# Altium schematic sheet IP2366_DEMO_V1.41(1).schdoc
size 406 x 279 mm
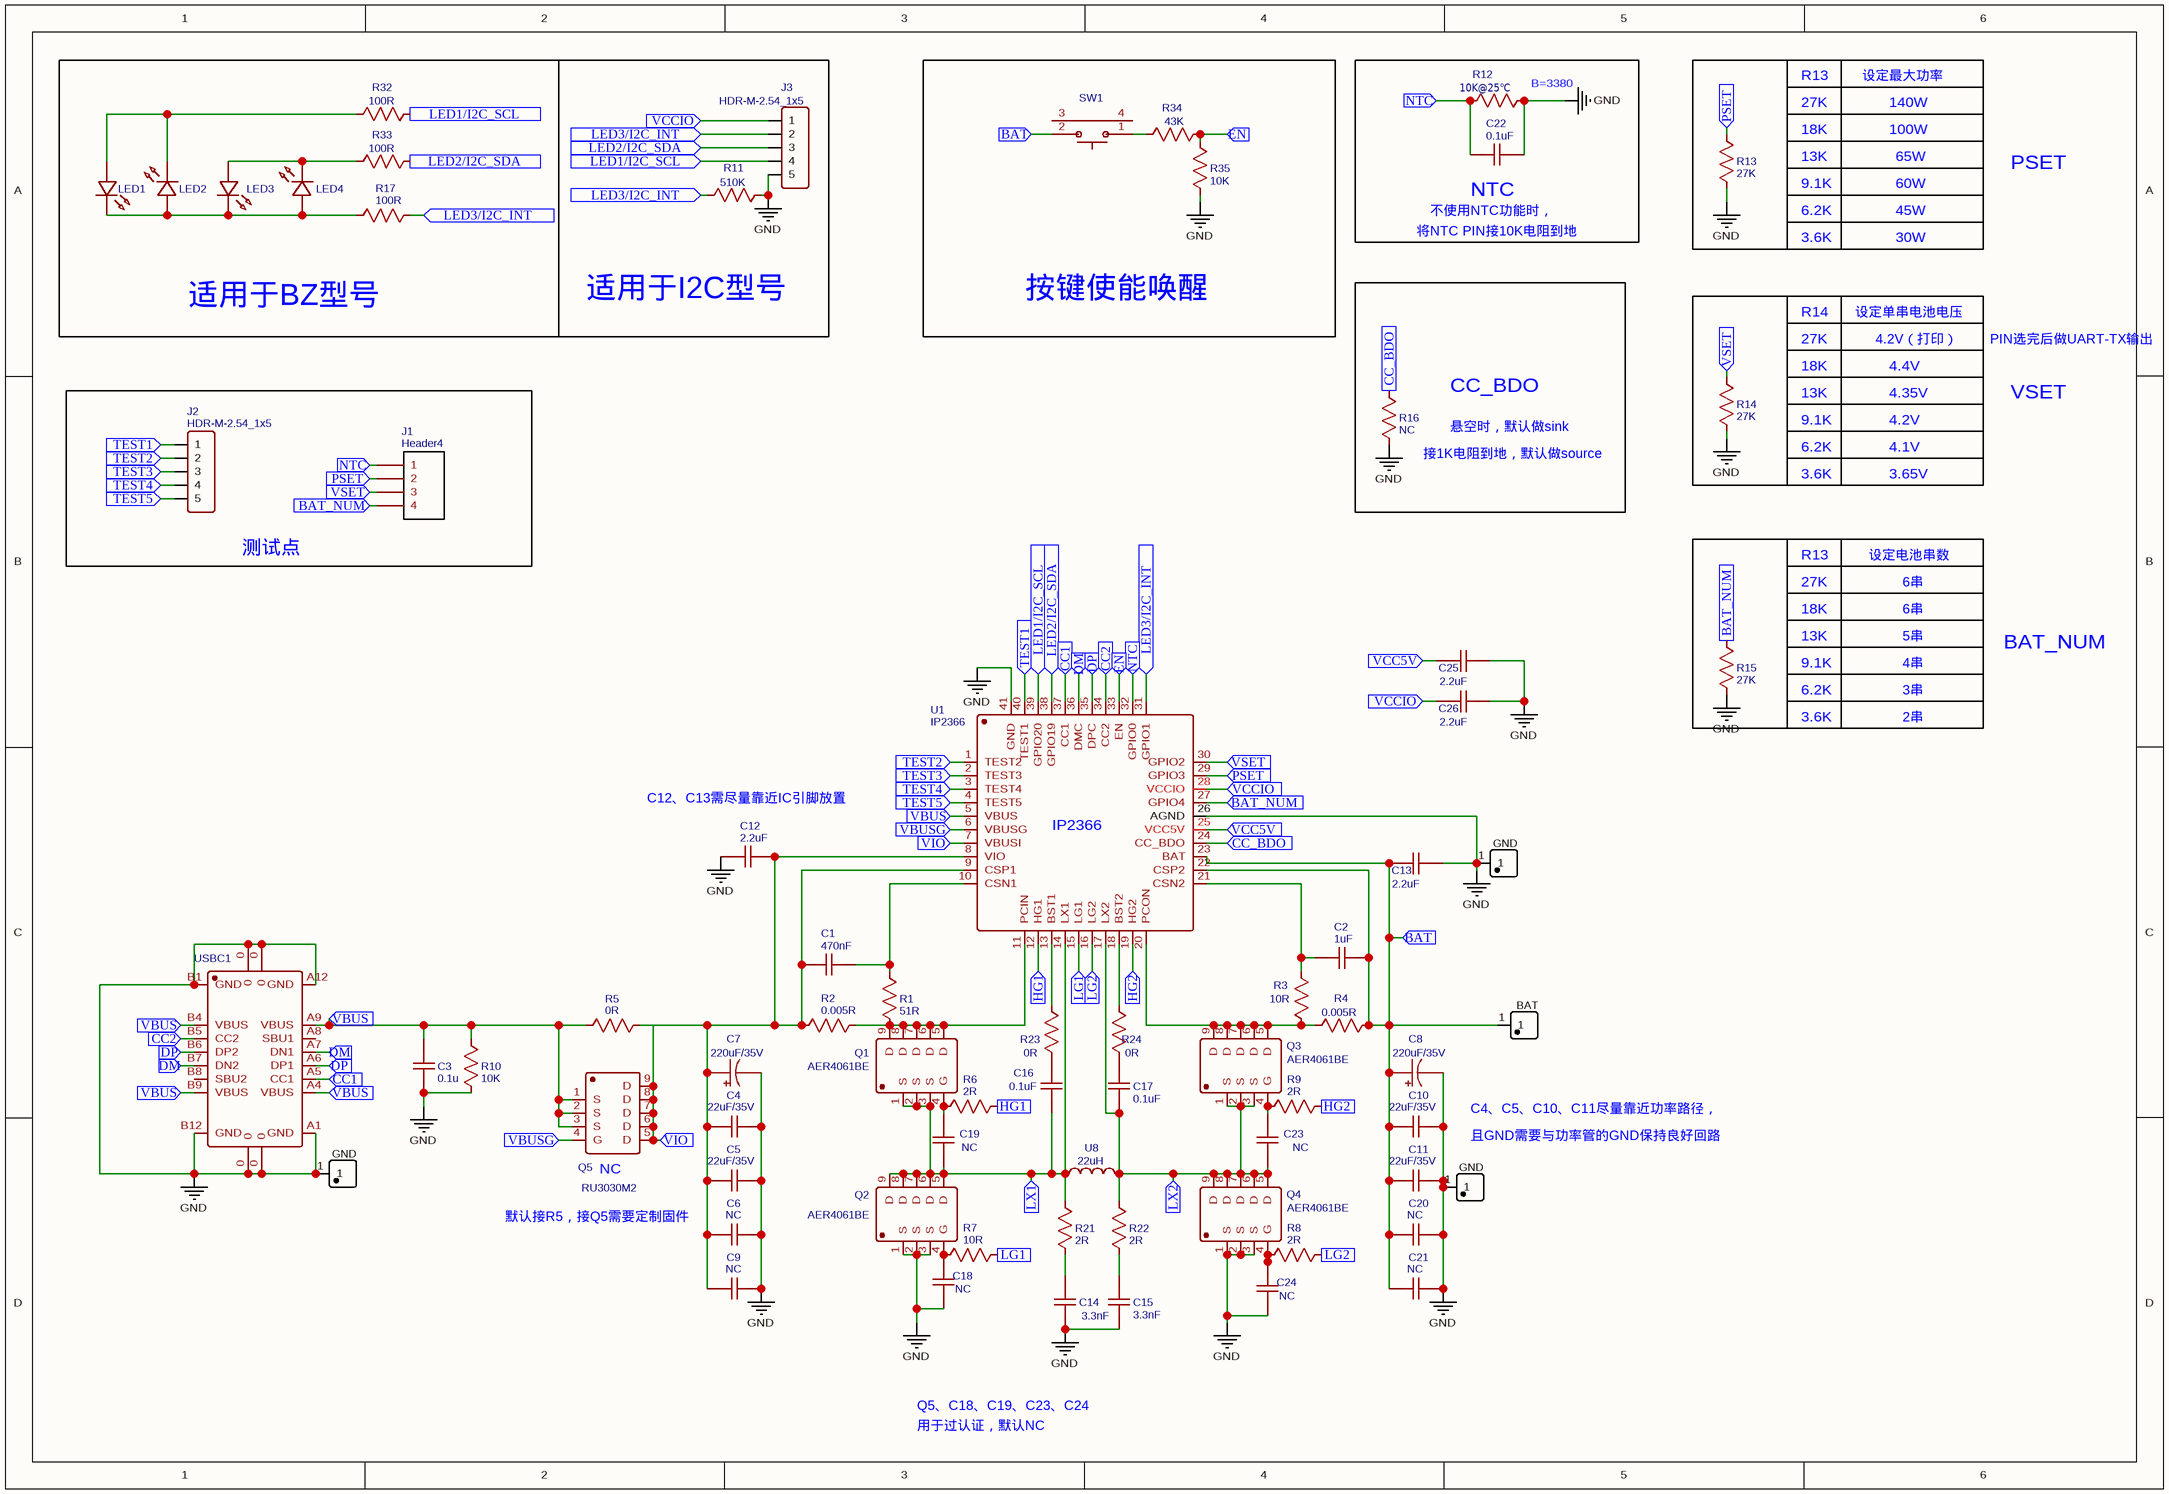
[diagram p0: IP2366_DEMO_V1.41(1).schdoc]

## Parts
C1  470nF  [C0603]
C2  1uF  [C0603]
C3  0.1u  [C0603]
C4  22uF/35V  [C1206]
C5  22uF/35V  [C1206]
C6  NC  [C1206]
C7  220uF/35V  [CAP-D6.3-F2.5]
C8  220uF/35V  [CAP-D6.3-F2.5]
C9  NC  [C1206]
C10  22uF/35V  [C1206]
C11  22uF/35V  [C1206]
C12  2.2uF  [C0603]
C13  2.2uF  [C0603]
C14  3.3nF  [C0603]
C15  3.3nF  [C0603]
C16  0.1uF  [C0603]
C17  0.1uF  [C0603]
C18  NC  [C0603]
C19  NC  [C0603]
C20  NC  [C1206]
C21  NC  [C1206]
C22  0.1uF  [C0603]
C23  NC  [C0603]
C24  NC  [C0603]
C25  2.2uF  [C0603]
C26  2.2uF  [C0603]
J1  Header4  [HEADER4]
J2  HDR-M-2.54_1x5  [HDR-M-2.54_1X5]
J3  HDR-M-2.54_1x5  [HDR-M-2.54_1X5]
LED1  LED-0603_B  [LED0603_BLUE]  (value not drawn)
LED2  LED-0603_B  [LED0603_BLUE]  (value not drawn)
LED3  LED-0603_B  [LED0603_BLUE]  (value not drawn)
LED4  LED-0603_B  [LED0603_BLUE]  (value not drawn)
Q1  AER4061BE  [DFN-8_L5.2-W5.6-P1.27-LS6.1-BL]
Q2  AER4061BE  [DFN-8_L5.2-W5.6-P1.27-LS6.1-BL]
Q3  AER4061BE  [DFN-8_L5.2-W5.6-P1.27-LS6.1-BL]
Q4  AER4061BE  [DFN-8_L5.2-W5.6-P1.27-LS6.1-BL]
Q5  RU3030M2  [PDFN3333-8_L3.1-W3.2-P0.65-LS3.4-BL]
R1  51R  [R0603]
R2  0.005R  [R1206]
R3  10R  [R0603]
R4  0.005R  [R1206]
R5  0R  [R1206]
R6  2R  [R0603]
R7  10R  [R0603]
R8  2R  [R0603]
R9  2R  [R0603]
R10  10K  [R0603]
R11  510K  [R0603]
R12  10K@25℃  [R0603]
R13  27K  [R0603]
R14  27K  [R0603]
R15  27K  [R0603]
R16  NC  [R0603]
R17  100R  [R0603]
R21  2R  [R0603]
R22  2R  [R0603]
R23  0R  [R0603]
R24  0R  [R0603]
R32  100R  [R0603]
R33  100R  [R0603]
R34  43K  [R0603]
R35  10K  [R0603]
SW1  1TS002G-1900-3500-CT  [KEY-SMD_1TS002G]  (value not drawn)
U1  IP2366  [QFN-40_L5.0-W5.0-P0.40-TL-EP3.4]
U3  GND  [TESTPOINT-TH_BD3.2]
U4  BAT  [TESTPOINT-TH_BD3.2]
U5  GND  [TESTPOINT-TH_BD3.2]
U8  22uH  [IND-TH_L23.0-W12.0-P9.00-D1.3]
U9  GND  [TESTPOINT-TH_BD3.2]
USBC1  TYPE-C-31-M-12  [USB-C_SMD-TYPE-C-31-M-12]  (value not drawn)

## Blocks framed on the sheet
按键使能唤醒: R34 R35 SW1
NTC: C22 R12
CC_BDO: R16
测试点: J1 J2

## Ports
BAT (in), BAT_NUM (in), CC1 (in), CC2 (in), CC_BDO (in), DM (in), DP (in), EN (in), HG1 (in), HG2 (in), LED1/I2C_SCL (in), LED2/I2C_SDA (in), LED3/I2C_INT (in), LG1 (in), LG2 (in), LX1 (in), LX2 (in), NTC (in), PSET (in), TEST1 (in), TEST2 (in), TEST3 (in), TEST4 (in), TEST5 (in), VBUS (in), VBUSG (in), VCC5V (in), VCCIO (in), VIO (in), VSET (in)

## Nets
GND: C3.1 C4.2 C5.2 C6.2 C7.2 C8.2 C9.2 C10.2 C11.2 C12.1 C13.2 C14.2 C15.2 C18.2 C20.2 C21.2 C22.2 C24.2 C25.2 C26.2 J3.5 Q2.1(S) Q2.2(S) Q2.3(S) Q4.1(S) Q4.2(S) Q4.3(S) R10.2 R11.2 R12.1 R13.1 R14.1 R15.1 R16.1 R35.2 U1.26(AGND) U1.41(GND) U3.1 U5.1 U9.1 USBC1.0 USBC1.A1(GND) USBC1.A12(GND) USBC1.B1(GND) USBC1.B12(GND)
BAT: C2.2 C8.1 C10.1 C11.1 C13.1 C20.1 C21.1 R4.2 SW1.2 U1.22(CSP2) U1.23(BAT) U4.1 ; port BAT
BAT_NUM: J1.4 R15.2 U1.27(GPIO4) ; port BAT_NUM
CC1: U1.37(CC1) USBC1.A5(CC1) ; port CC1
CC2: U1.34(CC2) USBC1.B5(CC2) ; port CC2
CC_BDO: R16.2 U1.24(CC_BDO) ; port CC_BDO
DM: U1.36(DMC) USBC1.A7(DN1) USBC1.B7(DN2) ; port DM
DP: U1.35(DPC) USBC1.A6(DP1) USBC1.B6(DP2) ; port DP
EN: R34.1 R35.1 U1.33(EN) ; port EN
HG1: R6.2 U1.12(HG1) ; port HG1
HG2: R9.2 U1.19(HG2) ; port HG2
LED1/I2C_SCL: J3.4 R32.1 U1.39(GPIO20) ; port LED1/I2C_SCL
LED2/I2C_SDA: J3.3 R33.1 U1.38(GPIO19) ; port LED2/I2C_SDA
LED3/I2C_INT: J3.2 R11.1 R17.2 U1.31(GPIO1) ; port LED3/I2C_INT
LG1: R7.2 U1.15(LG1) ; port LG1
LG2: R8.2 U1.16(LG2) ; port LG2
LX1: C16.2 C19.2 Q1.1(S) Q1.2(S) Q1.3(S) Q2.5(D) Q2.6(D) Q2.7(D) Q2.8(D) Q2.9(D) R21.2 U1.14(LX1) U8.1 ; port LX1
LX2: C17.2 C23.2 Q3.1(S) Q3.2(S) Q3.3(S) Q4.5(D) Q4.6(D) Q4.7(D) Q4.8(D) Q4.9(D) R22.2 U1.17(LX2) U8.2 ; port LX2
NTC: C22.1 J1.1 R12.2 U1.32(GPIO0) ; port NTC
PSET: J1.2 R13.2 U1.29(GPIO3) ; port PSET
TEST1: J2.1 U1.40(TEST1) ; port TEST1
TEST2: J2.2 U1.1(TEST2) ; port TEST2
TEST3: J2.3 U1.2(TEST3) ; port TEST3
TEST4: J2.4 U1.3(TEST4) ; port TEST4
TEST5: J2.5 U1.4(TEST5) ; port TEST5
VBUS: C3.2 Q5.1(S) Q5.2(S) Q5.3(S) R5.1 R10.1 U1.5(VBUS) USBC1.A4(VBUS) USBC1.A9(VBUS) USBC1.B4(VBUS) USBC1.B9(VBUS) ; port VBUS
VBUSG: Q5.4(G) U1.6(VBUSG) ; port VBUSG
VCC5V: C25.1 U1.25(VCC5V) ; port VCC5V
VCCIO: C26.1 J3.1 U1.28(VCCIO) ; port VCCIO
VIO: C1.1 C4.1 C5.1 C6.1 C7.1 C9.1 C12.2 Q5.5(D) Q5.6(D) Q5.7(D) Q5.8(D) Q5.9(D) R2.1 R5.2 U1.7(VBUSI) U1.8(VIO) U1.9(CSP1) ; port VIO
VSET: J1.3 R14.2 U1.30(GPIO2) ; port VSET
NetC1_2: C1.2 R1.2 U1.10(CSN1)
NetC2_1: C2.1 R3.2 U1.21(CSN2)
NetC14_1: C14.1 R21.1
NetC15_1: C15.1 R22.1
NetC16_1: C16.1 R23.2
NetC17_1: C17.1 R24.1
NetC18_1: C18.1 Q2.4(G) R7.1
NetC19_1: C19.1 Q1.4(G) R6.1
NetC23_1: C23.1 Q3.4(G) R9.1
NetC24_1: C24.1 Q4.4(G) R8.1
NetLED1_1: LED1.1 LED2.2 R32.2
NetLED1_2: LED1.2 LED2.1 LED3.2 LED4.1 R17.1
NetLED3_1: LED3.1 LED4.2 R33.2
NetQ1_5: Q1.5(D) Q1.6(D) Q1.7(D) Q1.8(D) Q1.9(D) R1.1 R2.2 U1.11(PCIN)
NetQ3_5: Q3.5(D) Q3.6(D) Q3.7(D) Q3.8(D) Q3.9(D) R3.1 R4.1 U1.20(PCON)
NetR23_1: R23.1 U1.13(BST1)
NetR24_2: R24.2 U1.18(BST2)
NetR34_2: R34.2 SW1.1

Not connected (* = marked no-connect by the designer): SW1 3 4; USBC1 A8(SBU1) B8(SBU2)

## Notes on the sheet
- (near R12) B=3380
- R13
- 设定最大功率
- 27K
- 18K
- 13K
- 100W
- 140W
- 65W
- (near C22) 不使用NTC功能时，
- 9.1K
- 6.2K
- 60W
- 45W
- PSET
- 适用于I2C型号
- 将NTC PIN接10K电阻到地
- 3.6K
- 30W
- 适用于BZ型号
- R14
- 设定单串电池电压
- 4.2V（打印）
- PIN选完后做UART-TX输出
- 悬空时，默认做sink
- 4.4V
- 4.35V
- 4.2V
- VSET
- (near R16) 接1K电阻到地，默认做source
- 3.65V
- 4.1V
- 设定电池串数
- 6串
- 5串
- 4串
- 3串
- BAT_NUM
- 2串
- (near C12) C12、C13需尽量靠近IC引脚放置
- C4、C5、C10、C11尽量靠近功率路径，
- (near Q5) NC
- 且GND需要与功率管的GND保持良好回路
- 默认接R5，接Q5需要定制固件
- Q5、C18、C19、C23、C24
- 用于过认证，默认NC

## Library data of the parts
C1 = 470nF: nameAlias: Value(F); Contributor: LCEDA_Lib; spicePre: C; spiceSymbolName: C_0603_US
C2 = 1uF: nameAlias: Value(F); Contributor: LCEDA_Lib; spicePre: C; spiceSymbolName: C_0603_US
C3 = 0.1u: nameAlias: Value(F); Contributor: LCEDA_Lib; spicePre: C; spiceSymbolName: C_0603_US
C4 C5 C10 C11 = 22uF/35V: nameAlias: Value(F); Contributor: LCEDA_Lib; spicePre: C; spiceSymbolName: C_1206_US
C6 C9 C18-C21 C23 C24 = NC: nameAlias: Value(F); Contributor: LCEDA_Lib; spicePre: C
  C6 C9 C20 C21: spiceSymbolName: C_1206_US
  C18 C19 C23 C24: spiceSymbolName: C_0603_US
C7 C8 = 220uF/35V: BOM_Manufacturer: BERYL Electronic Tech; BOM_Manufacturer Part: RC050M4R7LO5*11TH-2A1E; nameAlias: Capacitance; Contributor: s-dawn; BOM_Supplier: LCSC; BOM_Supplier Part: C365767; BOM_JLCPCB Part Class: Extended Part; spicePre: C; spiceSymbolName: C1
C12 C13 C25 C26 = 2.2uF: nameAlias: Value(F); Contributor: LCEDA_Lib; spicePre: C; spiceSymbolName: C_0603_US
C14 C15 = 3.3nF: nameAlias: Value(F); Contributor: LCEDA_Lib; spicePre: C; spiceSymbolName: C_0603_US
C16 C17 C22 = 0.1uF: nameAlias: Value(F); Contributor: LCEDA_Lib; spicePre: C; spiceSymbolName: C_0603_US
J1 = Header4: Contributor: hrqmmm1; spicePre: U; spiceSymbolName: Header4
J2 J3 = HDR-M-2.54_1x5: Contributor: LCEDA_Lib; BOM_Supplier Part: C358687; BOM_Supplier: LCSC; spicePre: J; spiceSymbolName: HDR-M-2.54_1x5
LED1-LED4 = LED-0603_B: BOM_Manufacturer: EVERLIGHT(台湾亿光); BOM_Manufacturer Part: 19-217/BHC-ZL1M2RY/3T; Contributor: LCEDA_01; BOM_Supplier Part: C72041; BOM_Supplier: LCSC; spicePre: L; spiceSymbolName: LED-0603_B
Q1-Q4 = AER4061BE: BOM_Manufacturer: Ruichips; BOM_Manufacturer Part: RU3090M; Contributor: LCSC; BOM_Supplier: LCSC; BOM_Supplier Part: C160654; BOM_JLCPCB Part Class: Extended Part; spicePre: Q; spiceSymbolName: RU3090M
Q5 = RU3030M2: BOM_Manufacturer: Ruichips; Contributor: LCSC; BOM_Supplier: LCSC; BOM_Manufacturer Part: RU3030M2; BOM_Supplier Part: C180957; BOM_JLCPCB Part Class: Extended Part; spicePre: Q; spiceSymbolName: RU3030M2
R1 = 51R: nameAlias: Value(Ω); Contributor: LCEDA_Lib; spicePre: R; spiceSymbolName: R_0603_US
R2 R4 = 0.005R: nameAlias: Value(Ω); Contributor: LCEDA_Lib; spicePre: R; spiceSymbolName: R_1206_US
R3 R7 = 10R: nameAlias: Value(Ω); Contributor: LCEDA_Lib; spicePre: R; spiceSymbolName: R_0603_US
R5 R23 R24 = 0R: nameAlias: Value(Ω); Contributor: LCEDA_Lib; spicePre: R
  R5: spiceSymbolName: R_1206_US
  R23 R24: spiceSymbolName: R_0603_US
R6 R8 R9 R21 R22 = 2R: nameAlias: Value(Ω); Contributor: LCEDA_Lib; spicePre: R; spiceSymbolName: R_0603_US
R10 R35 = 10K: nameAlias: Value(Ω); Contributor: LCEDA_Lib; spicePre: R; spiceSymbolName: R_0603_US
R11 = 510K: nameAlias: Value(Ω); Contributor: LCEDA_Lib; spicePre: R; spiceSymbolName: R_0603_US
R12 = 10K@25℃: nameAlias: Value(Ω); Contributor: LCEDA_Lib; spicePre: R; spiceSymbolName: R_0603_US
R13-R15 = 27K: nameAlias: Value(Ω); Contributor: LCEDA_Lib; spicePre: R; spiceSymbolName: R_0603_US
R16 = NC: nameAlias: Value(Ω); Contributor: LCEDA_Lib; spicePre: R; spiceSymbolName: R_0603_US
R17 R32 R33 = 100R: nameAlias: Value(Ω); Contributor: LCEDA_Lib; spicePre: R; spiceSymbolName: R_0603_US
R34 = 43K: nameAlias: Value(Ω); Contributor: LCEDA_Lib; spicePre: R; spiceSymbolName: R_0603_US
SW1 = 1TS002G-1900-3500-CT: BOM_Manufacturer: HYP; Contributor: LCSC; BOM_Supplier: LCSC; BOM_Supplier Part: C319376; BOM_Manufacturer Part: 1TS002G-1900-3500-CT; BOM_JLCPCB Part Class: Extended Part; spicePre: S; spiceSymbolName: 1TS002G-1900-3500-CT
U1 = IP2366: Contributor: cong24; spicePre: U; spiceSymbolName: IP2366
U3 U5 U9 = GND: BOM_Manufacturer: null; BOM_Manufacturer Part: TP-红色测试点; Contributor: lcsc; BOM_Supplier: LCSC; BOM_Supplier Part: C9900007423; link: https://atta.szlcsc.comnull; BOM_JLCPCB Part Class: Extended Part; spicePre: U; spiceSymbolName: TP-红色测试点
U4 = BAT: BOM_Manufacturer: null; BOM_Manufacturer Part: TP-红色测试点; Contributor: lcsc; BOM_Supplier: LCSC; BOM_Supplier Part: C9900007423; link: https://atta.szlcsc.comnull; BOM_JLCPCB Part Class: Extended Part; spicePre: U; spiceSymbolName: TP-红色测试点
U8 = 22uH: BOM_Manufacturer: PROD(谱罗德); BOM_Manufacturer Part: PDMTAT068125-100MLU; Contributor: lcsc; BOM_Supplier: LCSC; BOM_Supplier Part: C3011538; link: https://atta.szlcsc.com/upload/public/pdf/source/20220512/C2D76F48AC99E22DC9ADDA10AFDA7CBC.pdf; spicePre: U; spiceSymbolName: PDMTAT068125-100MLU
USBC1 = TYPE-C-31-M-12: BOM_Manufacturer: Rectangular Connectors - Contacts; Contributor: LCSC; BOM_Supplier: LCSC; BOM_Supplier Part: C165948; BOM_Manufacturer Part: TYPE-C-31-M-12; spicePre: U; spiceSymbolName: TYPE-C-31-M-12